# Altium schematic sheet BMS Module.SchDoc
size A4
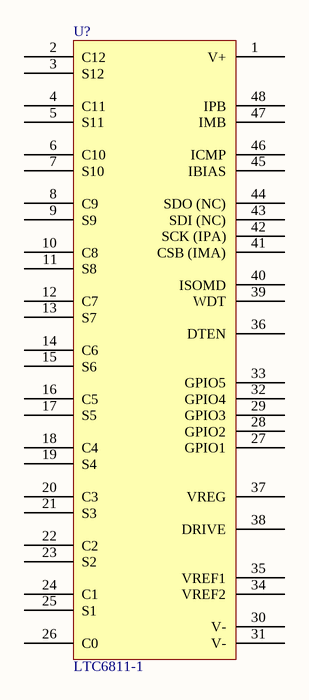
[diagram p0: BMS Module.SchDoc]

## Parts
U?  LTC6811-1  [LT 48-SSOP]

## Nets

Not connected (* = marked no-connect by the designer): U? 1(V+) 2(C12) 3(S12) 4(C11) 5(S11) 6(C10) 7(S10) 8(C9) 9(S9) 10(C8) 11(S8) 12(C7) 13(S7) 14(C6) 15(S6) 16(C5) 17(S5) 18(C4) 19(S4) 20(C3) 21(S3) 22(C2) 23(S2) 24(C1) 25(S1) 26(C0) 27(GPIO1) 28(GPIO2) 29(GPIO3) 30(V-) 31(V-) 32(GPIO4) 33(GPIO5) 34(VREF2) 35(VREF1) 36(DTEN) 37(VREG) 38(DRIVE) 39(WDT) 40(ISOMD) 41(CSB_(IMA)) 42(SCK_(IPA)) 43(SDI_(NC)) 44(SDO_(NC)) 45(IBIAS) 46(ICMP) 47(IMB) 48(IPB)

## Library data of the parts
U? = LTC6811-1: Battery Battery Monitor IC Multi-Chemistry 48-SSOP; Manufacturer: Analog Devices; Part Number: LTC6811-1; Digikey Part Number: LTC6811HG-1#PBF-ND; Digikey Link: https://www.digikey.com/product-detail/en/linear-technology-analog-devices/LTC6811HG-1-PBF/LTC6811HG-1-PBF-ND/6235369